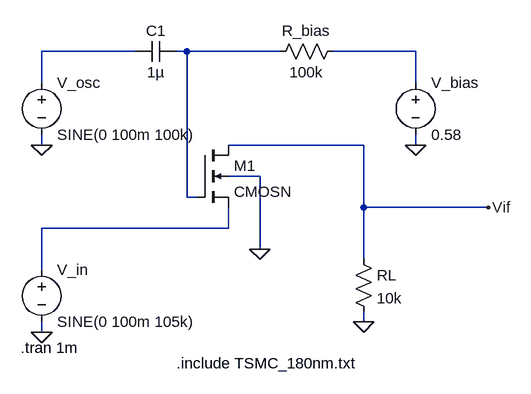
[diagram p0: schematic mixer_updated.asc]
mixer_updated.asc, the LTspice schematic file:
Version 4
SHEET 1 880 680
WIRE 112 64 -32 64
WIRE 192 64 176 64
WIRE 336 64 192 64
WIRE 544 64 416 64
WIRE -32 112 -32 64
WIRE 544 112 544 64
WIRE -32 208 -32 192
WIRE 464 208 256 208
WIRE 544 208 544 192
WIRE 304 256 256 256
WIRE 192 288 192 64
WIRE 208 288 192 288
WIRE 464 304 464 208
WIRE 656 304 464 304
WIRE 256 336 256 304
WIRE 256 336 -32 336
WIRE 304 368 304 256
WIRE 464 384 464 304
WIRE -32 400 -32 336
WIRE 464 480 464 464
WIRE -32 496 -32 480
FLAG -32 208 0
FLAG 544 208 0
FLAG -32 496 0
FLAG 464 480 0
FLAG 304 368 0
FLAG 656 304 Vif
SYMBOL voltage -32 96 R0
WINDOW 123 0 0 Left 0
WINDOW 39 0 0 Left 0
SYMATTR InstName V_osc
SYMATTR Value SINE(0 100m 100k)
SYMBOL voltage -32 384 R0
WINDOW 123 0 0 Left 0
WINDOW 39 0 0 Left 0
SYMATTR InstName V_in
SYMATTR Value SINE(0 100m 105k)
SYMBOL voltage 544 96 R0
WINDOW 123 0 0 Left 0
WINDOW 39 0 0 Left 0
SYMATTR InstName V_bias
SYMATTR Value 0.58
SYMBOL res 448 368 R0
SYMATTR InstName RL
SYMATTR Value 10k
SYMBOL res 432 48 R90
WINDOW 0 0 56 VBottom 2
WINDOW 3 32 56 VTop 2
SYMATTR InstName R_bias
SYMATTR Value 100k
SYMBOL cap 176 48 R90
WINDOW 0 0 32 VBottom 2
WINDOW 3 32 32 VTop 2
SYMATTR InstName C1
SYMATTR Value 1µ
SYMBOL nmos4 208 208 R0
SYMATTR InstName M1
SYMATTR Value2 l=0.09u w=1.8u ad=0.81p as=0.81p pd=4.5u ps=4.5u
SYMATTR Value CMOSN
TEXT -64 520 Left 2 !.tran 1m
TEXT 176 544 Left 2 !.include TSMC_180nm.txt

The netlist it stands for:
* mixer_updated.asc
V_osc N001 0 SINE(0 100m 100k)
V_in N004 0 SINE(0 100m 105k)
V_bias N003 0 0.58
RL Vif 0 10k
R_bias N003 N002 100k
C1 N002 N001 1µ
M1 Vif N002 N004 0 CMOSN l=0.09u w=1.8u ad=0.81p as=0.81p pd=4.5u ps=4.5u
.model NMOS NMOS
.model PMOS PMOS
.lib standard.mos
.tran 1m
.include TSMC_180nm.txt
.backanno
.end